# EAGLE design voicemodulator_schm (EAGLE 9.2.0)
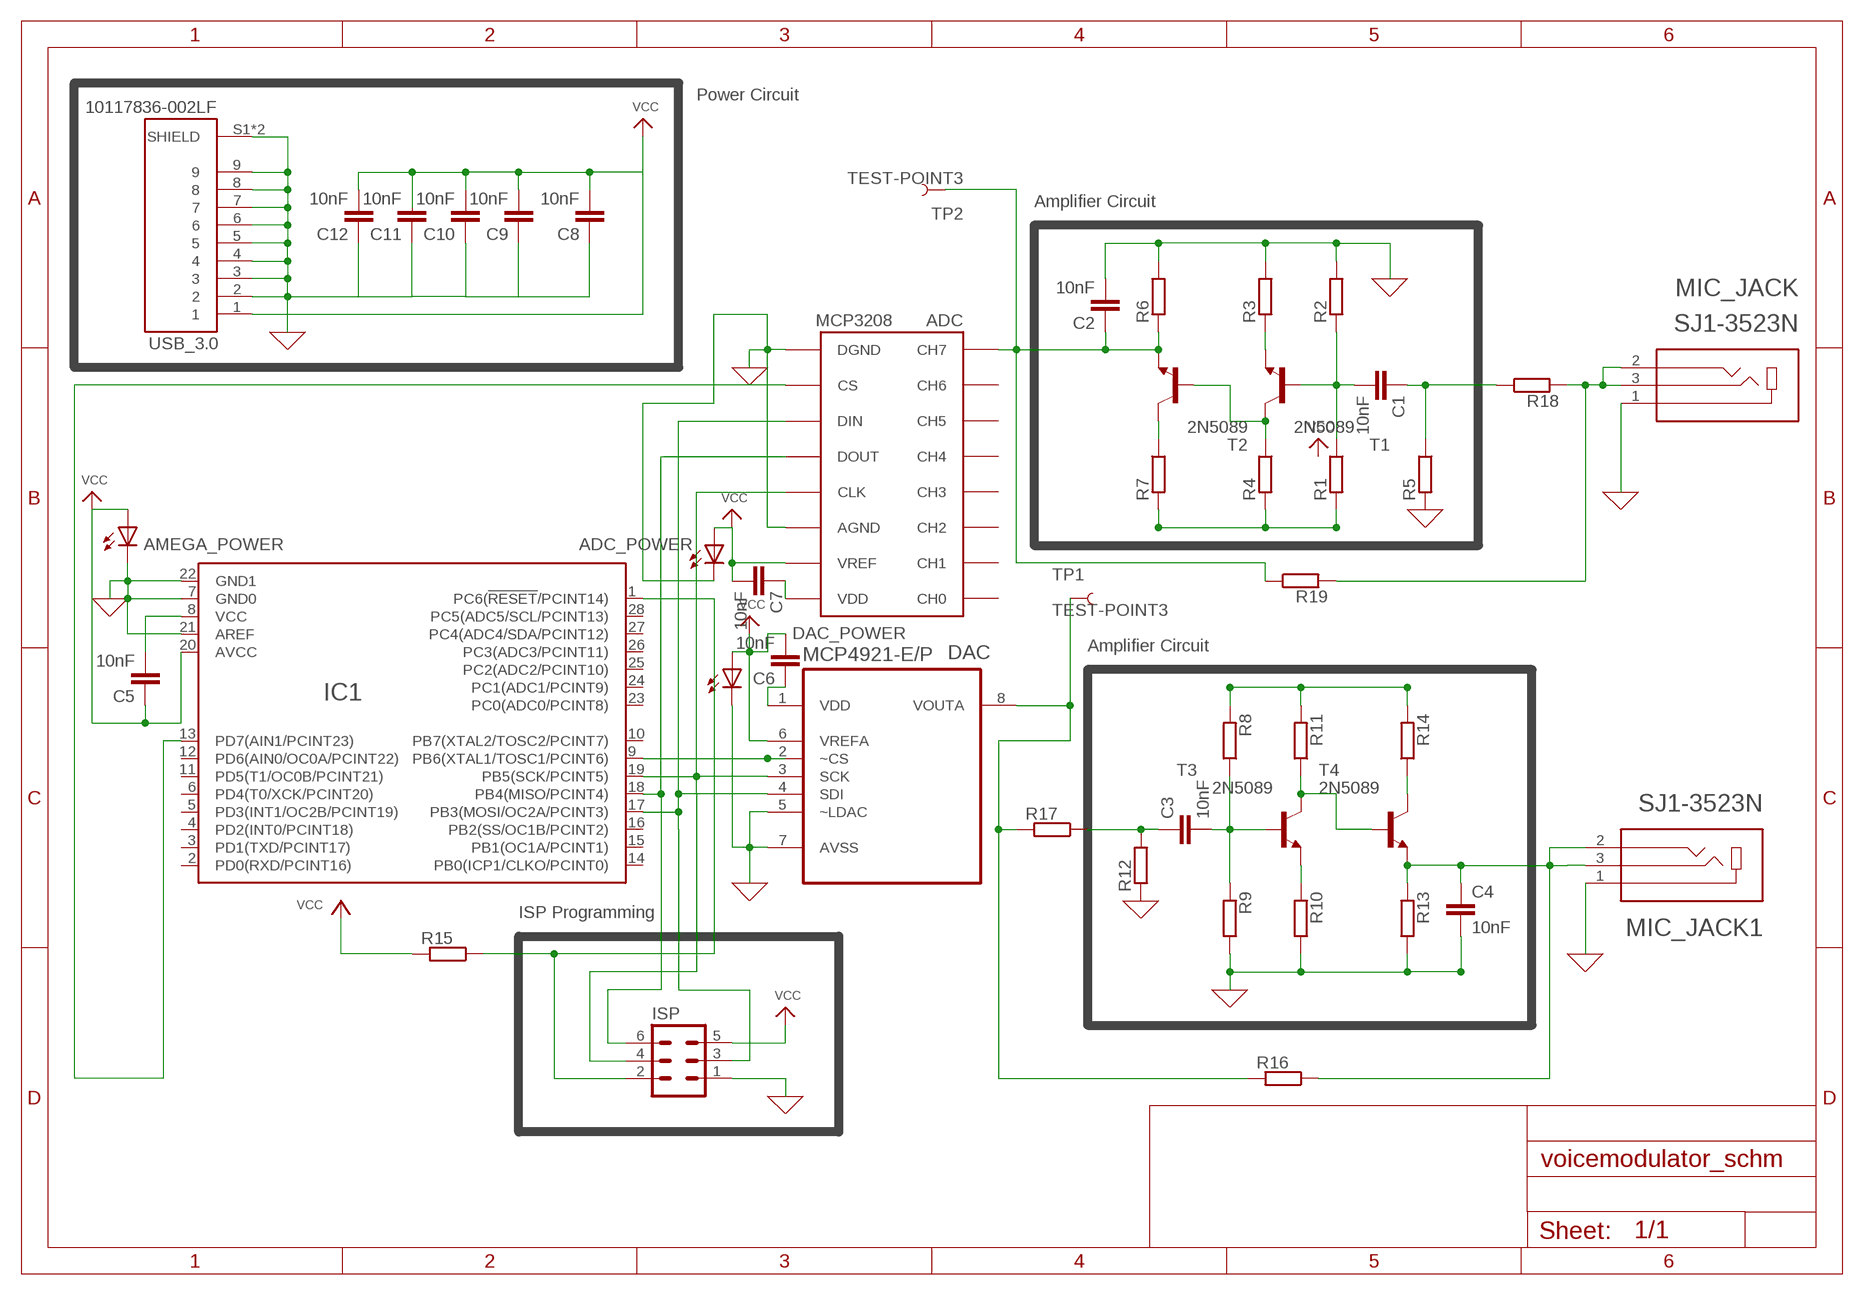
[diagram p0: schematic, sheet 1]

## Parts
ADC  MCP3208  [DIL16]
ADC_POWER  LED10MM  [LED10MM]
AMEGA_POWER  LED10MM  [LED10MM]
C1  10nF  10NF-0603-50V-10%  [0603]
C2  10nF  10NF-0603-50V-10%  [0603]
C3  10nF  10NF-0603-50V-10%  [0603]
C4  10nF  10NF-0603-50V-10%  [0603]
C5  10nF  10NF-0603-50V-10%  [0603]
C6  10nF  10NF-0603-50V-10%  [0603]
C7  10nF  10NF-0603-50V-10%  [0603]
C8  10nF  10NF-0603-50V-10%  [0603]
C9  10nF  10NF-0603-50V-10%  [0603]
C10  10nF  10NF-0603-50V-10%  [0603]
C11  10nF  10NF-0603-50V-10%  [0603]
C12  10nF  10NF-0603-50V-10%  [0603]
DAC  MCP4921-E/P  [DIP254P762X432-8]
DAC_POWER  LED10MM  [LED10MM]
IC1  ATMEGA48/88/168/328-PU(DIP28)PU  [DIL28]
ISP  MA03-2  [MA03-2]
MIC_JACK  SJ1-3523N  [CUI_SJ1-3523N]
MIC_JACK1  SJ1-3523N  [CUI_SJ1-3523N]
R1  SMR-WAV  [SMS-WAV]
R2  SMR-WAV  [SMS-WAV]
R3  SMR-WAV  [SMS-WAV]
R4  SMR-WAV  [SMS-WAV]
R5  SMR-WAV  [SMS-WAV]
R6  SMR-WAV  [SMS-WAV]
R7  SMR-WAV  [SMS-WAV]
R8  SMR-WAV  [SMS-WAV]
R9  SMR-WAV  [SMS-WAV]
R10  SMR-WAV  [SMS-WAV]
R11  SMR-WAV  [SMS-WAV]
R12  SMR-WAV  [SMS-WAV]
R13  SMR-WAV  [SMS-WAV]
R14  SMR-WAV  [SMS-WAV]
R15  SMR-WAV  [SMS-WAV]
R16  SMR-WAV  [SMS-WAV]
R17  SMR-WAV  [SMS-WAV]
R18  SMR-WAV  [SMS-WAV]
R19  SMR-WAV  [SMS-WAV]
T1  2N5089  [TO92]
T2  2N5089  [TO92]
T3  2N5089  [TO92]
T4  2N5089  [TO92]
TP1  TEST-POINT3  [PAD.03X.03]
TP2  TEST-POINT3  [PAD.03X.03]
USB_3.0  10117836-002LF  [AMPHENOL_10117836-002LF]

## Nets
GND: ADC.AGND ADC.DGND ADC_POWER.K(C) AMEGA_POWER.K(C) C2.2 C4.2 C8.1 C9.1 C10.1 C11.1 C12.1 DAC.5(~LDAC) DAC.7(AVSS) DAC_POWER.K(C) IC1.7(GND0) IC1.21(AREF) IC1.22(GND1) ISP.1 MIC_JACK1.1 MIC_JACK.1 R2.1 R3.1 R5.2 R6.1 R9.1 R10.1 R12.2 R13.1 USB_3.0.2 USB_3.0.3 USB_3.0.4 USB_3.0.5 USB_3.0.6 USB_3.0.7 USB_3.0.8 USB_3.0.9 USB_3.0.S1(SHIELD) USB_3.0.S2(SHIELD)
N$1: C1.1 R5.1 R18.1
N$2: ADC.DOUT IC1.18(PB4(MISO/PCINT4)) ISP.6
N$3: C1.2 R1.1 R2.2 T1.2(B)
N$4: DAC.8(VOUTA) R16.2 R17.2 TP1.P$1
N$5: ADC.CH7 C2.1 R6.2 R19.1 T2.3(E) TP2.P$1
N$6: R7.1 T2.1(C)
N$7: R3.2 T1.3(E)
N$8: R4.1 T1.1(C) T2.2(B)
N$9: C3.2 R8.1 R9.2 T3.2(B)
N$10: R1.2 R4.2 R7.2
N$11: C4.1 MIC_JACK1.2 MIC_JACK1.3 R13.2 R16.1 T4.3(E)
N$12: R14.1 T4.1(C)
N$13: R10.2 T3.3(E)
N$14: R11.1 T3.1(C) T4.2(B)
N$15: R8.2 R11.2 R14.2
N$16: ADC.DIN DAC.4(SDI) IC1.17(PB3(MOSI/OC2A/PCINT3)) ISP.3
N$17: ADC.CLK DAC.3(SCK) IC1.19(PB5(SCK/PCINT5)) ISP.4
N$18: C6.1 DAC.1(VDD)
N$19: ADC.CS IC1.13(PD7(AIN1/PCINT23))
N$20: DAC.2(~CS) IC1.9(PB6(XTAL1/TOSC1/PCINT6))
N$21: ADC.VDD C7.1
N$22: IC1.1(PC6(!RESET!/PCINT14)) ISP.2 R15.1
N$23: C3.1 R12.1 R17.1
N$24: MIC_JACK.2 MIC_JACK.3 R18.2 R19.2
N$25: C5.2 IC1.8(VCC)
VCC: ADC.VREF ADC_POWER.A AMEGA_POWER.A C5.1 C6.2 C7.2 C8.2 C9.2 C10.2 C12.2 DAC.6(VREFA) DAC_POWER.A IC1.20(AVCC) ISP.5 R15.2 USB_3.0.1
Unconnected: ADC.CH0 ADC.CH1 ADC.CH2 ADC.CH3 ADC.CH4 ADC.CH5 ADC.CH6 C11.2 IC1.2(PD0(RXD/PCINT16)) IC1.3(PD1(TXD/PCINT17)) IC1.4(PD2(INT0/PCINT18)) IC1.5(PD3(INT1/OC2B/PCINT19)) IC1.6(PD4(T0/XCK/PCINT20)) IC1.10(PB7(XTAL2/TOSC2/PCINT7)) IC1.11(PD5(T1/OC0B/PCINT21)) IC1.12(PD6(AIN0/OC0A/PCINT22)) IC1.14(PB0(ICP1/CLKO/PCINT0)) IC1.15(PB1(OC1A/PCINT1)) IC1.16(PB2(SS/OC1B/PCINT2)) IC1.23(PC0(ADC0/PCINT8)) IC1.24(PC1(ADC1/PCINT9)) IC1.25(PC2(ADC2/PCINT10)) IC1.26(PC3(ADC3/PCINT11)) IC1.27(PC4(ADC4/SDA/PCINT12)) IC1.28(PC5(ADC5/SCL/PCINT13))

## Notes on the sheet
- Power Circuit
- Amplifier Circuit
- Amplifier Circuit
- ISP Programming

## Library data of the parts
ADC = mcp3208:MCP3208
ADC_POWER AMEGA_POWER DAC_POWER = led:LED: LED OSRAM: - CHIPLED LG R971, LG N971, LY N971, LG Q971, LY Q971, LO R971, LY R971 LH N974, LH R974 LS Q976, LO Q976, LY Q976 LO Q996 - Hyper CHIPLED LW Q18S LB Q993, LB Q99A, LB R99A - SideLED LS A670, LO A670, LY A670, LG A670, LP A670 LB A673, LV A673, LT A673, LW A673 LH A674 LY A675 LS A676, LA A676, LO A676, LY A676, LW A676 LS A679, LY A679, LG A679 - Hyper Micro SIDELED® LS Y876, LA Y876, LO Y876, LY Y876 LT Y87S - SmartLED LW L88C, LW L88S LB L89C, LB L89S, LG L890 LS L89K, LO L89K, LY L89K LS L896, LA L896, LO L896, LY L896 - TOPLED LS T670, LO T670, LY T670, LG T670, LP T670 LSG T670, LSP T670, LSY T670, LOP T670, LYG T670 LG T671, LOG T671, LSG T671 LB T673, LV T673, LT T673, LW T673 LH T674 LS T676, LA T676, LO T676, LY T676, LB T676, LH T676, LSB T676, LW T676 LB T67C, LV T67C, LT T67C, LS T67K, LO T67K, LY T67K, LW E67C LS E67B, LA E67B, LO E67B, LY E67B, LB E67C, LV E67C, LT E67C LW T67C LS T679, LY T679, LG T679 LS T770, LO T770, LY T770, LG T770, LP T770 LB T773, LV T773, LT T773, LW T773 LH T774 LS E675, LA E675, LY E675, LS T675 LS T776, LA T776, LO T776, LY T776, LB T776 LHGB T686 LT T68C, LB T68C - Hyper Mini TOPLED® LB M676 - Mini TOPLED Santana® LG M470 LS M47K, LO M47K, LY M47K Source: http://www.osram.convergy.de LUXEON: - LUMILED® LXK2-PW12-R00, LXK2-PW12-S00, LXK2-PW14-U00, LXK2-PW14-V00 LXK2-PM12-R00, LXK2-PM12-S00, LXK2-PM14-U00 LXK2-PE12-Q00, LXK2-PE12-R00, LXK2-PE12-S00, LXK2-PE14-T00, LXK2-PE14-U00 LXK2-PB12-K00, LXK2-PB12-L00, LXK2-PB12-M00, LXK2-PB14-N00, LXK2-PB14-P00, LXK2-PB14-Q00 LXK2-PR12-L00, LXK2-PR12-M00, LXK2-PR14-Q00, LXK2-PR14-R00 LXK2-PD12-Q00, LXK2-PD12-R00, LXK2-PD12-S00 LXK2-PH12-R00, LXK2-PH12-S00 LXK2-PL12-P00, LXK2-PL12-Q00, LXK2-PL12-R00 Source: www.luxeon.com KINGBRIGHT: KA-3528ASYC Source: www.kingbright.com
C1-C12 = SparkFun-Capacitors:10NF: 0.01uF/10nF/10,000pF ceramic capacitors A capacitor is a passive two-terminal electrical component used to store electrical energy temporarily in an electric field. CAP-09321; PROD_ID: CAP-00867
DAC = Microchip_By_element14_Batch_1:MCP4921-E/P: DAC; MPN: MCP4921-E/P; OC_FARNELL: 1332112; OC_NEWARK: 08J8743; PACKAGE: DIP-8; SUPPLIER: Microchip
IC1 = voicemod_parts:ATMEGA48/88/168/328-PU(DIP28)
ISP = con-lstb:MA03-2: PIN HEADER; OC_FARNELL: unknown; OC_NEWARK: unknown
MIC_JACK MIC_JACK1 = SJ1-3523N:SJ1-3523N: 3.5 mm Right-Angle Stereo Jack, 3 Pin PCB Mount, Non-Threaded; MANUFACTURER: CUI; PARTREV: 1.02; STANDARD: Manufacturer recommendation
R1-R19 = resistor-shunt:SMR-WAV: SMD SHUNT RESISTOR; OC_FARNELL: unknown; OC_NEWARK: unknown
T1-T4 = transistor:2N5089: NPN TRANSISTOR
TP1 TP2 = SparkFun-Connectors:TEST-POINT: SparkFun Test Points Bare copper test points for troubleshooting or In-Circuit-Testing. These are used by our Production team for verifying production board runs using pogo-pins on test beds. SparkFun Products: SparkFun LSM9DS1 Breakout <https://www.sparkfun.com/products/13284> SparkFun PSOC <https://www.sparkfun.com/products/13714> SparkFun Load Cell Amplifier <https://www.sparkfun.com/products/13879>
USB_3.0 = USB_SMT_3:10117836-002LF: Usb, 3.0 Type A, Receptacle, SMT; AVAILABILITY: Unavailable; DESCRIPTION: Usb, 3.0 Type A, Receptacle, SMT; MF: Amphenol FCI; MP: 10117836-002LF; PACKAGE: None; PRICE: None

## Board
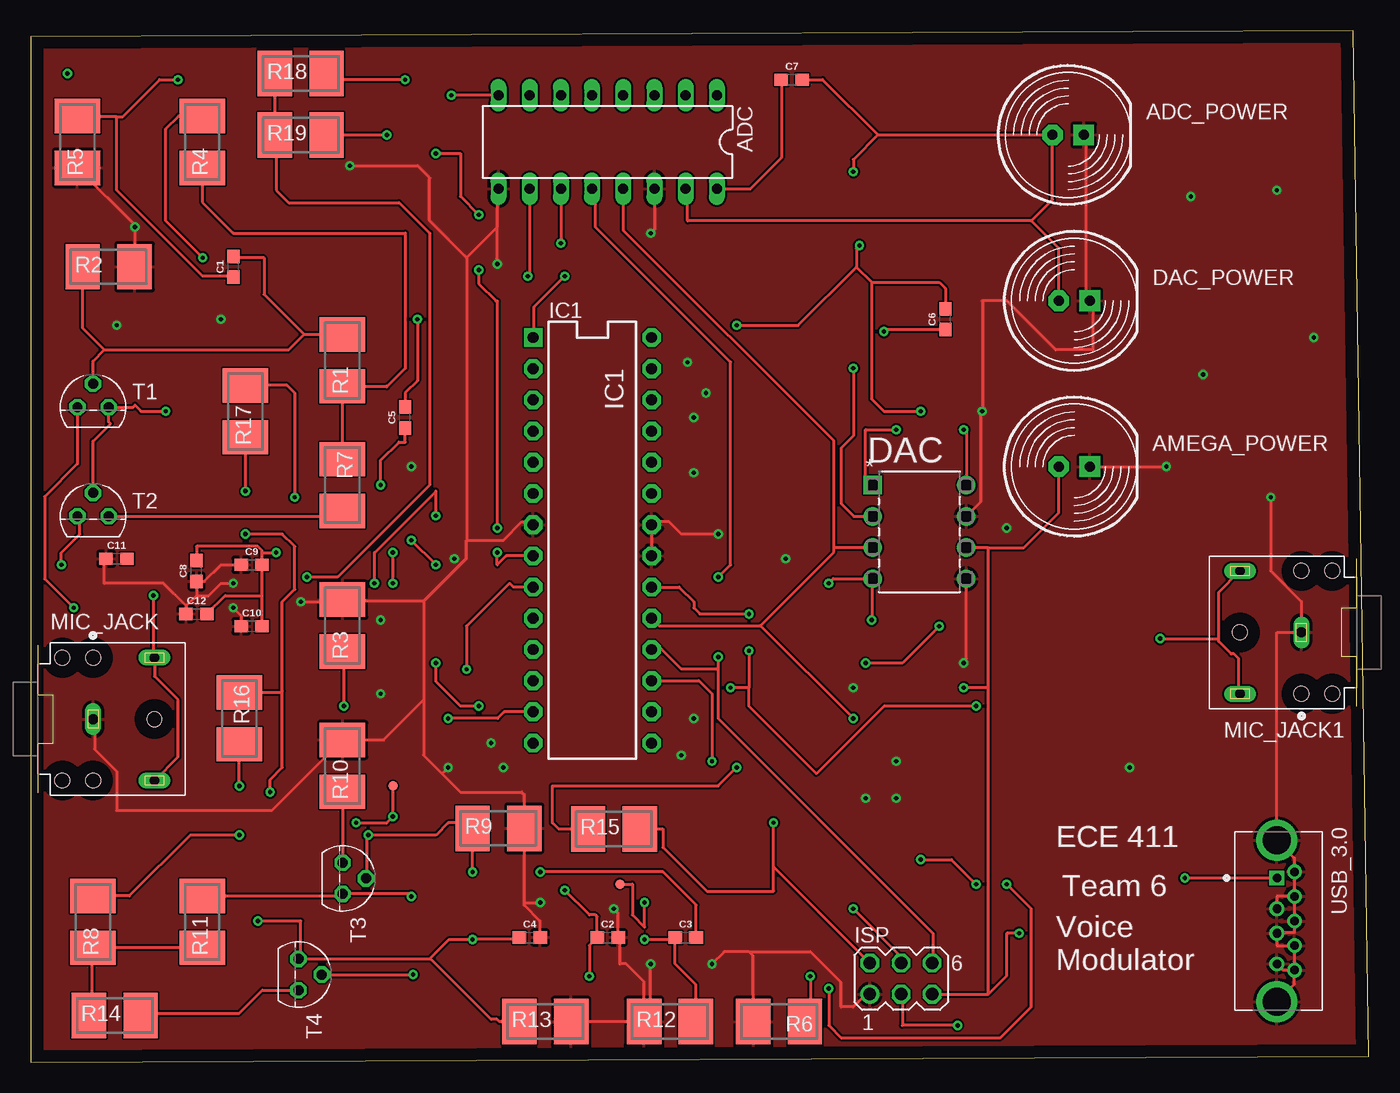
[diagram p1: board, top side]
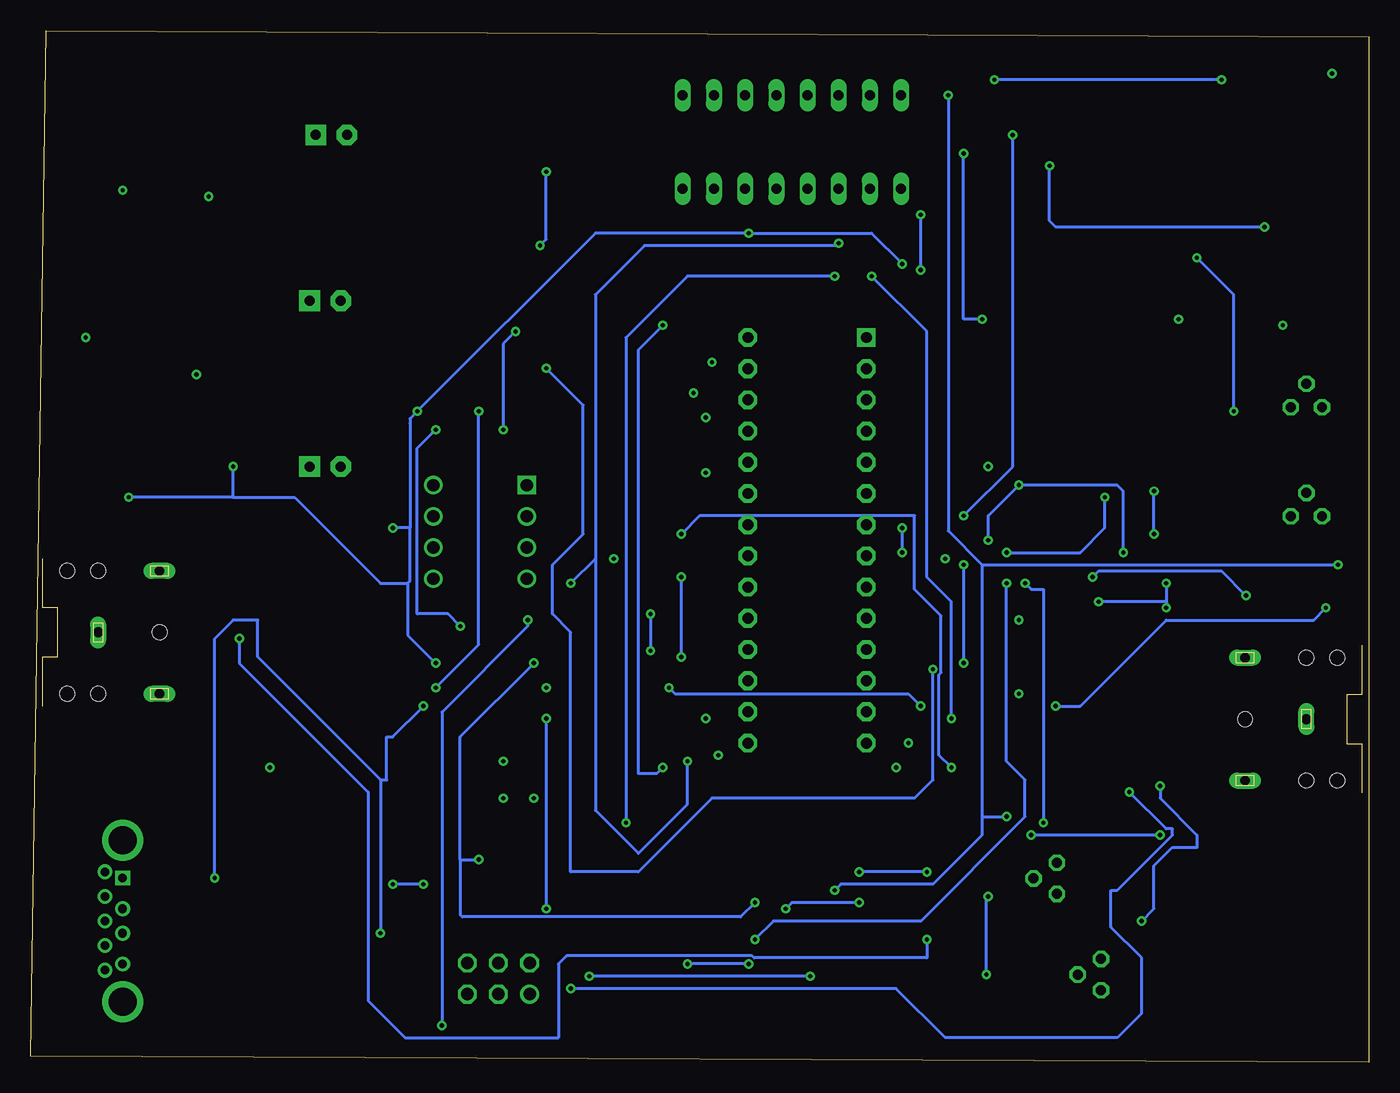
[diagram p2: board, bottom side, seen from below]

Size 108.99 x 83.99 mm. Coordinates in mm from the lower left corner, seen from the top.
Outline: 0,0 108.99,0.5 107.72,83.99 0,83.49 0,0
Copper layers (1*16): Top 0.035mm / dielectric 1.5mm / Bottom 0.035mm
Design rules "default *": minimum track width 10mil, minimum drill 0.35mm, track to track 6mil, track to pad 6mil, pad to pad 6mil, via to via 6mil, smd to smd 6mil, copper to edge 40mil, drill to drill 6mil, minimum pad ring 10mil, minimum via ring 8mil, stop-mask expansion 4mil, vias tented up to drill 0mil, thermal gap 10mil

### Footprints (pad centres in the part's own frame; a part is rotated, then mirrored left to right if it is on the bottom)
DIL16 = drill 0.813 long: AGND -3.81,3.81; CH0 -8.89,-3.81; CH1 -6.35,-3.81; CH2 -3.81,-3.81; CH3 -1.27,-3.81; CH4 1.27,-3.81; CH5 3.81,-3.81; CH6 6.35,-3.81; CH7 8.89,-3.81; CLK -1.27,3.81; CS 6.35,3.81; DGND 8.89,3.81; DIN 3.81,3.81; DOUT 1.27,3.81; VDD -8.89,3.81; VREF -6.35,3.81
LED10MM = drill 0.813 pad 1.676 octagon: A -1.27,0 | drill 0.813 pad 1.676 square: K 1.27,0
0603 = smd 1.1 x 1: 1 -0.85,0; 2 0.85,0
DIP254P762X432-8 = drill 0.991 square: 1 -7.62,7.62 | drill 0.991: 2 -7.62,5.08; 3 -7.62,2.54; 4 -7.62,0; 5 0,0; 6 0,2.54; 7 0,5.08; 8 0,7.62
DIL28 = drill 0.889 pad 1.524 square: 1 -16.51,-4.572 | drill 0.889 pad 1.524 octagon: 2 -13.97,-4.572; 3 -11.43,-4.572; 4 -8.89,-4.572; 5 -6.35,-4.572; 6 -3.81,-4.572; 7 -1.27,-4.572; 8 1.27,-4.572; 9 3.81,-4.572; 10 6.35,-4.572; 11 8.89,-4.572; 12 11.43,-4.572; 13 13.97,-4.572; 14 16.51,-4.572; 15 16.51,5.08; 16 13.97,5.08; 17 11.43,5.08; 18 8.89,5.08; 19 6.35,5.08; 20 3.81,5.08; 21 1.27,5.08; 22 -1.27,5.08; 23 -3.81,5.08; 24 -6.35,5.08; 25 -8.89,5.08; 26 -11.43,5.08; 27 -13.97,5.08; 28 -16.51,5.08
MA03-2 = drill 1.016: 1 -2.54,-1.27 | drill 1.016 octagon: 2 -2.54,1.27; 3 0,-1.27; 4 0,1.27; 5 2.54,-1.27; 6 2.54,1.27
CUI_SJ1-3523N = drill 0.8 long: 1 0,0; 2 5,-5; 3 5,5 | hole 1.2: -2.5,5; 0,5; 5,0; -2.5,-5; 0,-5
SMS-WAV = smd 2.8 x 3.7: 1 2.108,0; 2 -2.108,0
TO92 = drill 0.813 octagon: 1 1.27,0; 2 0,1.905; 3 -1.27,0
PAD.03X.03 = smd 0.762 x 0.762: P$1 0,0
AMPHENOL_10117836-002LF = drill 0.7 square: 1 -3.5,0 | drill 0.7: 2 -1,0; 3 1,0; 4 3.5,0; 5 4,1.44; 6 2,1.44; 7 0,1.44; 8 -2,1.44; 9 -4,1.44 | drill 2.3: S1 -6.57,0; S2 6.57,0

### Placement (x,y rotation side)
ADC  46.99,74.93 180 top
ADC_POWER  84.5,75.5 0 top
AMEGA_POWER  85,48.5 0 top
C1  16.51,64.77 90 top
C2  46.99,10.16 0 top
C3  53.34,10.16 0 top
C4  40.64,10.16 0 top
C5  30.5,52.5 90 top
C6  74.5,60.5 90 top
C7  62,80 0 top
C8  13.5,40 90 top
C9  18,40.5 0 top
C10  18,35.5 0 top
C11  7,41 0 top
C12  13.5,36.5 0 top
DAC  76.2,39.37 0 top
DAC_POWER  85,62 0 top
IC1  45.5,42.5 270 top
ISP  70.89,6.81 0 top
MIC_JACK  5.08,27.94 0 top
MIC_JACK1  103.5,35 180 top
R1  25.4,57.15 90 top
R2  6.35,64.77 0 top
R3  25.4,35.56 90 top
R4  13.97,74.93 90 top
R5  3.81,74.93 90 top
R6  60.96,3.31 180 top
R7  25.4,46.99 270 top
R8  5.08,11.43 90 top
R9  38.1,19.05 0 top
R10  25.4,24.13 90 top
R11  13.97,11.43 90 top
R12  52.07,3.31 0 top
R13  41.91,3.31 0 top
R14  6.85,3.81 0 top
R15  47.5,19 0 top
R16  17,28 270 top
R17  17.5,53 90 top
R18  22,80.5 0 top
R19  22,75.5 0 top
T1  5.08,53.34 0 top
T2  5.08,44.45 0 top
T3  25.4,14.97 270 top
T4  21.81,7.14 270 top
TP1  48,14.5 0 top
TP2  29.5,22.5 0 top
USB_3.0  101.5,11.5 270 top

### Tracks (layer width: path | path; a pad name or v marks a point on that pad's centre or on a via)
GND  (via drill 0.35)
  Top 0.254: ISP.1 68.04,5.54 67,4.5 66,4.5 66,6.5 63.5,9 58.5,9 | v55.5,8 56.5,9 58.5,9 | 58.5,9 58.83,8.67 58.83,5.5 58.85,5.48 R6.1 | AMEGA_POWER.K v92.5,48.5 | ADC_POWER.K 86,75.27 86,62 DAC_POWER.K 86.5,61.77 86.5,58 83.5,58 79.5,62 77.5,62 v77.5,53 77.38,52.88 77.38,45.62 DAC.7 | v50.5,67.5 50.8,67.8 ADC.AGND | v38,65 38,68 | 35.5,65.5 38,68 | 35.5,65.5 32.5,68.5 32.5,72 31.5,73 v26,73 | v56,43 53,43 52,44 50.81,44 IC1.22 IC1.21 | v76,32.5 76.2,32.7 DAC.5 | v101,46 101,40 103.5,37.5 MIC_JACK1.1 101.5,35 USB_3.0.S1 102.94,16.63 USB_3.0.9 USB_3.0.8 | USB_3.0.8 101.5,13.5 USB_3.0.2 | USB_3.0.8 USB_3.0.7 102.94,10.56 101.56,10.56 USB_3.0.3 101.5,9.5 USB_3.0.6 USB_3.0.5 | USB_3.0.5 102,7.5 USB_3.0.4 | USB_3.0.5 102.94,6.37 USB_3.0.S2 | R12.2 49.96,6.54 48.5,8 48,8 48,10 C2.2 47.84,12.16 v47.5,12.5 | R12.2 50.5,3.85 v50.5,8 | R12.2 R13.1 | 32,29.5 28.75,26.25 25.41,26.25 R10.1 19.66,20.5 7,20.5 7,23.71 5.21,25.5 5.21,27.81 MIC_JACK.1 | 32,29.5 32,25 33.5,23.5 | 33.5,23.5 v34,24 | 35.5,42.5 38.5,42.5 40,44 40.7,44 IC1.7 | 35.5,41 35.5,42.5 | 35.5,65.5 35.5,42.5 | 40.21,13 40.21,12.78 41.49,11.5 C4.2 | 40.21,13 40.21,16.5 40.21,18 R9.1 40.21,21.79 40,22 35,22 33.5,23.5 | 40.21,13 v41.5,13 | 32,37.5 32,29.5 | 32,37.5 31.97,37.53 | 31.97,37.53 25.53,37.53 | 31.97,37.53 35.43,41 35.5,41 | 35.5,41 32,37.5 | ADC.DGND 38,71.02 38,68 | R2.1 8.46,67.96 v8.5,68 8.5,68.13 R5.2 | C9.1 15.5,40.5 14.15,39.15 C8.1 13.5,38 | 13.5,38 12.65,37.15 | 12.65,37.15 C12.1 | 12.65,37.15 10.8,39 6,39 6,40.85 C11.1 | 13.5,38 14.5,38 15.5,39 v16.5,39 | C10.1 17.15,36.35 v16.5,37 | v22,37.5 25.5,37.5 25.53,37.53 | R3.1 25.53,37.53
  Bottom 0.254: 92.5,46 v92.5,48.5 | 92.5,46 v101,46 | 92.5,46 87.5,46 80.5,39 78.27,39 | 78.27,39 78.11,39.17 78.11,43.5 | 78.11,43.5 v79.5,43.5 | 78.27,39 78.27,34.77 v76,32.5 | v41.5,13 47,13 v47.5,12.5 | v34,24 35,25 35,31.57 34.84,31.73 34.84,36.34 37,38.5 37,44.5 54.5,44.5 v56,43 | v38,65 40.5,67.5 v50.5,67.5 63,67.5 v77.5,53 78.1,52.4 78.1,52.01 78.11,52 78.11,43.5 | v8.5,68 25.5,68 26,68.5 v26,73 | v16.5,39 16.5,37.5 | 16.5,37.5 v16.5,37 | 16.5,37.5 v22,37.5 | v50.5,8 v55.5,8
  other vias: 94.5,70.5 15.5,60.5 7,60 70.5,21.5 95.5,56 104.5,59 101.5,71 89.5,24 70.5,24.5 67,30.5 61.5,41 54,52.5 54,48 53.5,57 55,54.5 31,48.5 34.5,41 28.5,36 28.5,30 38.5,24 53,25 68,21.5 54,28 37.5,26
  pour Top: 0,83.5 0,0.5 109,0.5 109,83.5
N$1  (via drill 0.35)
  Top 0.254: v30.5,80 24,80 24.11,80.11 R18.1 | C1.1 16.43,64 14,64 7,71 7,77 | 7,77 3.85,77 R5.1 | 7,77 7.5,77 10.5,80 v12,80
  Bottom 0.254: v12,80 v30.5,80
N$2  (via drill 0.35)
  Top 0.254: v56,39.5 57,40.5 57,57 46,68 46,70.84 ADC.DOUT | ISP.6 73.5,8.15 73.5,10.5 56,28 56,32 | v56,33 56,32 | 56,32 53,32 51.39,33.61 IC1.18
  Bottom 0.254: v56,33 v56,39.5
N$3
  Top 0.254: R2.2 4.24,59.76 6,58 | T1.2 5.08,57.08 6,58 | 6,58 21,58 22.26,59.26 | C1.2 16.63,65.5 19,65.5 19,62.52 22.26,59.26 | 22.26,59.26 R1.1
N$4  (via drill 0.35)
  Top 0.254: v65,6 65,3 66,2 79,2 81.5,4.5 81.5,12.5 v79.5,14.5 | v76,51.5 76.2,51.3 DAC.8 | v68,32.5 71,32.5 v74,35.5 | TP1.P$1 49,14.5 49,12 50,11 v50,13 | v72.5,16.5 75,16.5 v77,14.5 | R16.2 20.39,30.11 20.5,30.22 | 20.5,30.22 20.5,37.5 21.5,38.5 21.5,42 20.5,43 v17.5,43 | v19.5,22 19.5,23 20.5,24 20.5,30.22 | v17.5,46.5 R17.2
  Bottom 0.254: v19.5,22 16.5,19 16,19 16,18.5 20.5,14 21,14 21,11 18.5,8.5 18.5,4 20.5,2 34.5,2 38.5,6 v65,6 | 74,16.5 74,12 73.84,11.84 51.16,11.84 v50,13 | v68,32.5 74,26.5 74,16.5 | 74,16.5 v72.5,16.5 | v74,35.5 75,36.5 77.5,36.5 77.5,50 v76,51.5 | v17.5,43 v17.5,46.5 | v77,14.5 v79.5,14.5
N$5  (via drill 0.35)
  Top 0.254: v63.5,7 63.5,3.5 63.63,3.37 63.13,3.37 R6.2 | v33,44.5 33,46.5 28,41.5 v28,39 | v45.5,7 45.5,9.52 C2.1 46.14,11.86 46,12 45.5,12 v43.5,14 | v2.5,40.5 2.5,41.5 4,43 4,44.26 T2.3 | v26.5,19.5 29,19.5 v29.5,20 TP2.P$1 | R19.1 v29,75.5 | ADC.CH7 v34.26,78.74
  Bottom 0.254: 31.5,40.5 v2.5,40.5 | 31.5,40.5 31.5,20 | 31.5,20 v29.5,20 | 31.5,20 31.5,18.5 35.5,14.5 43,14.5 v43.5,14 | v28,39 27.5,38.5 26.5,38.5 v26.5,19.5 | v34.26,78.74 34.26,43.26 31.5,40.5 | v33,44.5 29,48.5 v29,75.5 | v45.5,7 v63.5,7
N$6
  Top 0.254: T2.1 24.97,44.45 R7.1
N$7  (via drill 0.35)
  Top 0.254: R3.2 25.5,33.35 v25.5,29 | T1.3 3.81,48.72 1.14,46.05 1.14,39.36 v3.5,37
  Bottom 0.254: v25.5,29 23.5,29 16.5,36 4.5,36 v3.5,37
N$8  (via drill 0.35)
  Top 0.254: T2.2 5.08,50.58 6.5,52 6.35,52.15 T1.1 8.34,53.34 8.5,53.5 9,53 v11,53 | R4.1 12.04,77.04 11,76 11,68.5 v14,65.5
  Bottom 0.254: v11,53 11,62.5 v14,65.5
N$9  (via drill 0.35)
  Top 0.254: C3.2 54.19,12.81 51.5,15.5 v41.5,15.5 | v36,15.5 v35.99,15.51 R9.2 35.54,19.5 34,19.5 33,18.5 v27.5,18.5 27.42,18.42 27.42,15.08 T3.2 | v17,18.5 13,18.5 8.04,13.54 R8.1
  Bottom 0.254: v17,18.5 v27.5,18.5 | v36,15.5 v41.5,15.5
N$10
  Top 0.254: R4.2 13.97,70.03 16.5,67.5 30.5,67.5 30.5,56.5 29,55 28.96,55.04 R1.2 R7.2
N$11  (via drill 0.35)
  Top 0.254: v92,34.5 96.76,34.5 | 96.76,34.5 96.76,38.26 MIC_JACK1.2 | C4.1 39.63,10 v36,10 34.09,10 32.5,8.41 | v18.5,11.5 22,11.5 22,8.6 T4.3 32.5,8.41 | 32.5,8.41 32.59,8.41 37.5,3.5 38,3.5 38.19,3.31 R13.2 | C4.1 39.8,10.16 39.8,10.15 C4.1 | v17,22.5 R16.1 | MIC_JACK1.3 98.38,30.12 98.38,32.88 98,33.26 97.78,33.26 96.76,34.28 96.76,34.5 | R13.2 39.99,3.5 39.99,3.32 40,3.31 R13.2
  Bottom 0.254: v17,22.5 17,21.5 14,18.5 14,17.5 16,17.5 17.5,16 17.5,12.5 v18.5,11.5 | v92,34.5 92,32.5 81.5,22 81.5,5 78.5,2 66,2 66,8 65.34,8.66 50.23,8.66 50.07,8.5 36,8.5 v36,10
N$12
  Top 0.254: R14.1 9.15,4 17,4 18.87,5.87 T4.1
N$13
  Top 0.254: R10.2 T3.3
N$14  (via drill 0.35)
  Top 0.254: T4.2 v31.14,7.14 | R11.1 25.24,13.54 T3.1 30.8,13.7 v31,13.5
  Bottom 0.254: v31.14,7.14 31.14,13.36 v31,13.5
N$15
  Top 0.254: R11.2 R8.2 5,9.24 5,3.81 R14.2
N$16  (via drill 0.35)
  Top 0.254: v65,39 65.37,39.37 68.5,39.37 | v75.5,3 71,3 71,5.43 ISP.3 | IC1.17 54.43,31.07 55.5,30 v55.5,24.5 | ADC.DIN v43.18,66.68 | 68.5,39.37 v68.5,36 | DAC.4 68.5,39.37
  Bottom 0.254: 63,41 63,62.5 59,66.5 43.36,66.5 v43.18,66.68 | 63,41 v65,39 | 63,41 63,20.5 59.5,17 55.5,21 v55.5,24.5 | v68.5,36 68.5,35.5 75.5,28.5 v75.5,3
N$17  (via drill 0.35)
  Top 0.254: 65.41,41.91 65.41,50.59 48.26,67.74 ADC.CLK | 59.44,35.56 51.17,35.56 IC1.19 | 59.44,35.56 v67,28 | 59.44,35.56 65.41,41.53 65.41,41.91 | ISP.4 70.89,8.61 v67,12.5 | DAC.3 65.41,41.91
  Bottom 0.254: v67,28 v67,12.5
N$18  (via drill 0.35)
  Top 0.254: C6.1 69.65,59.65 v69.5,59.5 | DAC.1 68,47.57 68,51.5 v70.5,51.5
  Bottom 0.254: v69.5,59.5 70.5,58.5 v70.5,51.5
N$19  (via drill 0.35)
  Top 0.254: ADC.CS 40.64,64.14 v40.5,64 | v34,28 38.04,28 38.57,28.53 IC1.13
  Bottom 0.254: v40.5,64 36,59.5 36,39.5 34,37.5 v34,28
N$20  (via drill 0.35)
  Top 0.254: v67,56.5 67,51 66,50 66,45.5 67.05,44.45 DAC.2 | IC1.9 39.31,38.69 39,39 35.5,35.5 v35.5,32
  Bottom 0.254: v67,56.5 64,53.5 64,43 66.5,40.5 66.5,36.5 65,35 65,15.5 59.5,15.5 53.5,21.5 37,21.5 35.5,23 v35.5,32
N$21
  Top 0.254: ADC.VDD 58.62,71.12 61.15,73.65 C7.1
N$22  (via drill 0.35)
  Top 0.254: ISP.2 60.5,15.93 | 60.5,15.93 v60.5,19.5 | R15.1 51.5,19 51.5,17.5 55.07,13.93 60.5,13.93 60.5,15.93 | IC1.1 41,59.08 41,61.5 v43.5,64
  Bottom 0.254: v43.5,64 55.5,64 60.5,59 v60.5,19.5
N$23  (via drill 0.35)
  Top 0.254: R12.1 54.18,6.32 52.49,8.01 C3.1 52.33,10 v50,10 | R17.1 20.89,55.11 21.5,54.5 v21.5,46 | v29.5,39 v29.5,41.5
  Bottom 0.254: v50,10 48.5,11.5 36.5,11.5 28,20 28,23 29.5,24.5 v29.5,39 | v29.5,41.5 23.5,41.5 21.5,43.5 v21.5,46
N$24  (via drill 0.35)
  Top 0.254: v22.5,39.5 25,39.5 32.5,47 32.5,67.5 30,70 21,70 20,71 20,75.39 R19.2 R18.2 | v10,38 10,33.02 MIC_JACK.3 10.08,31.42 12,29.5 12,24.86 MIC_JACK.2
  Bottom 0.254: v22.5,39.5 22,40 12,40 v10,38
N$25  (via drill 0.35)
  Top 0.254: v33,74 35,74 35,70.5 v36.5,69 | v38,41.5 38,40.5 38.73,41.23 IC1.8 | v36.5,64.5 36.5,63.39 37.89,62 38,62 v38,43.5 | v31.5,60.5 31.5,55.5 30.5,54.5 C5.2
  Bottom 0.254: v31.5,60.5 33,60.5 v33,74 | v36.5,64.5 v36.5,69 | v38,41.5 v38,43.5
N$26  (via drill 0.35)
  other vias: 3,80.5
VCC  (via drill 0.35)
  Top 0.254: v80.5,10.5 79.5,10.5 79.5,7.04 78,5.54 | 78,5.54 78,30.5 | 78,30.5 v76,30.5 | 78,30.5 78,41.91 | 78,41.91 DAC.6 | 78,41.91 80.91,41.91 83.73,44.73 AMEGA_POWER.A | DAC_POWER.A 83.73,66.27 81.5,68.5 | 81.5,68.5 83.23,70.23 ADC_POWER.A 69,75.5 | 81.5,68.5 53.5,68.5 53.5,70.84 53.34,71 ADC.VREF | C7.2 64.5,80 69,75.5 | 69,75.5 67,73.5 v67,72.5 | IC1.20 52.81,38.69 54.01,37.49 54.01,37 54.51,36.5 v58.5,36.5 | 58.5,30.5 58.5,29 64,23.5 69.5,29 v77,29 | v72.5,53 69.5,53 68.5,54 68.5,63.5 | 68.5,63.5 74,63.5 74.5,63 C6.2 | 68.5,63.5 67.25,64.75 | v57.5,60 62.5,60 67.25,64.75 | USB_3.0.1 v94,15 | R15.2 43,19 42.5,19.5 42.5,22.5 56,22.5 v57.5,24 | v33,40.5 v31,42.5 | v36.5,29 35,29 33,31 v33,32.5 | v28.5,47 28.5,49 30,50.5 30.5,50.5 C5.1 | 67.25,64.75 67.25,66.25 v67.5,66.5 | ISP.5 78,5.54 | v58.5,33.5 58.5,30.5 | C10.2 18.85,38 | 18.85,38 C9.2 18.85,41.5 | 18.85,41.5 18.85,41.65 18.5,42 13.5,42 C8.2 | C12.2 15.85,38 18.85,38 | 18.85,41.5 v20,41.5 | 58.5,30.5 v57,30.5
  Bottom 0.254: v57.5,24 58,23.5 59.5,23.5 59.5,58 v57.5,60 | v33,40.5 v33,32.5 | v57,30.5 56.5,30 37.5,30 v36.5,29 | v94,15 94,34.5 92.5,36 90.5,36 90.5,33 80.5,23 | v31,42.5 31,44.5 v28.5,47 20.5,47 20,46.5 v20,41.5 | 80.5,23 80,23 80,26.5 79.5,26.5 v77,29 | 80.5,23 v80.5,10.5 | v76,30.5 72.5,34 v72.5,53 | v67.5,66.5 67,67 v67,72.5 | v58.5,36.5 v58.5,33.5

### Text on the board
tNames: ECE 411 | Team 6 | Voice / Modulator